# EAGLE design esp01-rs485 (EAGLE 7.2.0)
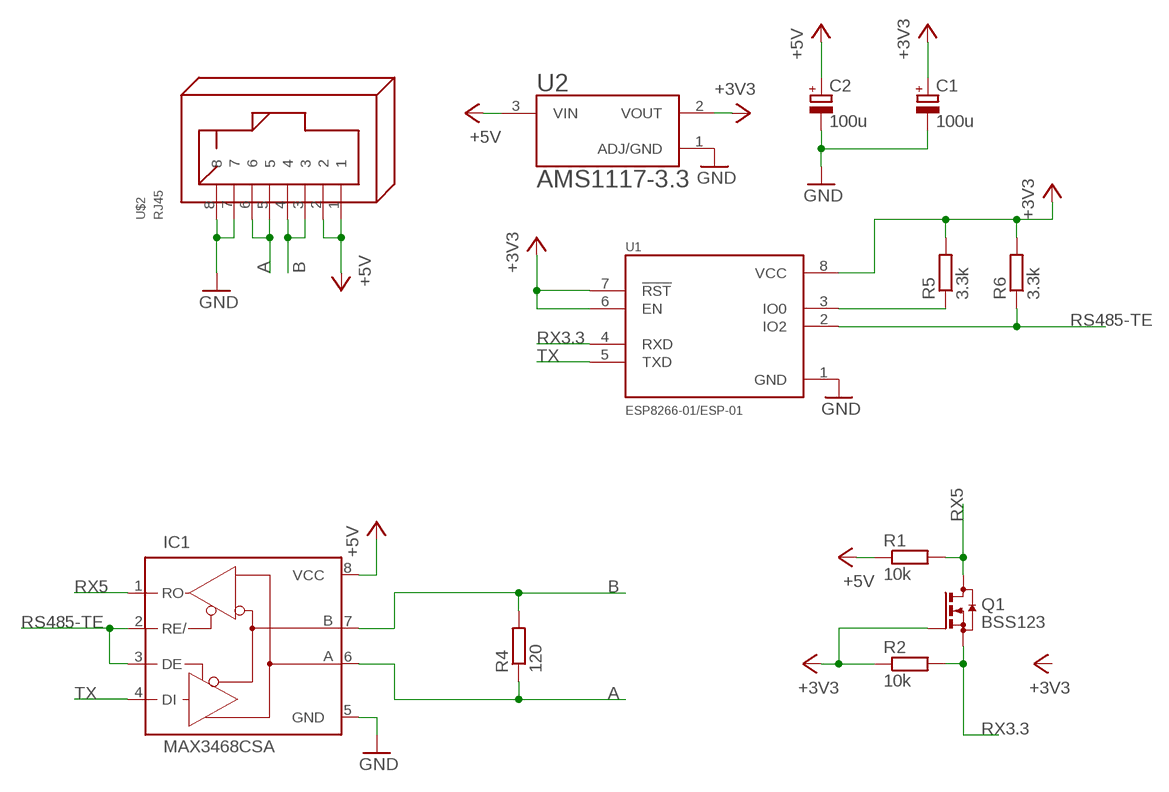
[diagram p0: schematic, sheet 1]

## Parts
C1  100u  CPOL-EUE2.5-6  [E2,5-6]
C2  100u  CPOL-EUE2.5-6  [E2,5-6]
IC1  MAX3468CSA  [SO08]
Q1  BSS123  [SOT23]
R1  10k  R-EU_M1206  [M1206]
R2  10k  R-EU_M1206  [M1206]
R4  120  R-EU_M1206  [M1206]
R5  3.3k  R-EU_M1206  [M1206]
R6  3.3k  R-EU_M1206  [M1206]
U1  ESP8266-01/ESP-01  [XCVR_ESP8266-01/ESP-01]
U2  AMS1117-3.3  [SOT229P700X180-4N]
U$2  RJ45  [RJ45]

## Nets
+3V3: C1.+ Q1.1(G) R2.1 R5.2 R6.2 U1.6(EN) U1.7(!RST) U1.8(VCC) U2.2(VOUT)
+5V: C2.+ IC1.8(VCC) R1.1 U2.3(VIN) U$2.1 U$2.2
A: IC1.6(A) R4.1 U$2.5 U$2.6
B: IC1.7(B) R4.2 U$2.3 U$2.4
GND: C1.- C2.- IC1.5(GND) U1.1(GND) U2.1(ADJ/GND) U$2.7 U$2.8
N$1: R5.1 U1.3(IO0)
RS485-TE: IC1.2(RE/) IC1.3(DE) R6.1 U1.2(IO2)
RX3.3: Q1.2(S) R2.2 U1.4(RXD)
RX5: IC1.1(RO) Q1.3(D) R1.2
TX: IC1.4(DI) U1.5(TXD)

## Library data of the parts
C1 C2 = rcl:CPOL-EU: POLARIZED CAPACITOR, European symbol
IC1 = maxim:MAX34*: +5V, Fail-Safe, 40Mbps, Profibus RS-485/RS-422 Transceivers Source: MAX3465-MAX3469.pdf; MPN: MAX3468CSA+; OC_FARNELL: unknown; OC_NEWARK: 76K6721
Q1 = transistor-small-signal:BSS123: N-CHANNEL MOS FET
R1 R2 R4-R6 = rcl:R-EU_: RESISTOR, European symbol
U1 = ESP8266-01_ESP-01:ESP8266-01/ESP-01: MakerFocus 4pcs ESP8266 ESP-01 Serial Wireless WiFi Transceiver Receiver Module 1MB SPI Flash DC3.0-3.6V Internet of Things WiFi Module Board Compatible with Ar duino Check prices <https://pricing.snapeda.com/parts/ESP8266-01/ESP-01/AI-Thinker/view-part?ref=eda>; AVAILABILITY: Not in stock; DESCRIPTION: MakerFocus 4pcs ESP8266 ESP-01 Serial Wireless WiFi Transceiver Receiver Module 1MB SPI Flash DC3.0-3.6V Internet of Things WiFi Module Board Compatible with Ar duino; MF: AI-Thinker; MP: ESP8266-01/ESP-01; PACKAGE: Non-Standard AI-Thinker; PRICE: None
U2 = AMS1117-3.3:AMS1117-3.3: Sot223/Pkg 1-Amp 3.3-Volt Low Drop Out Voltage Regulatator Check prices <https://pricing.snapeda.com/parts/AMS1117-3.3/Advanced%20Monolithic%20Systems/view-part?ref=eda>; AVAILABILITY: In Stock; DESCRIPTION: LDO Voltage Regulators 800MA LDO LINEAR REG; MF: Advanced Monolithic Systems; MP: AMS1117-3.3; PACKAGE: SOT-223 Seeed Technology; PRICE: None
U$2 = con-rj:RJ45: RJ45 RJ45 jacks side mounted http://www.tycoelectronics.com

## Board
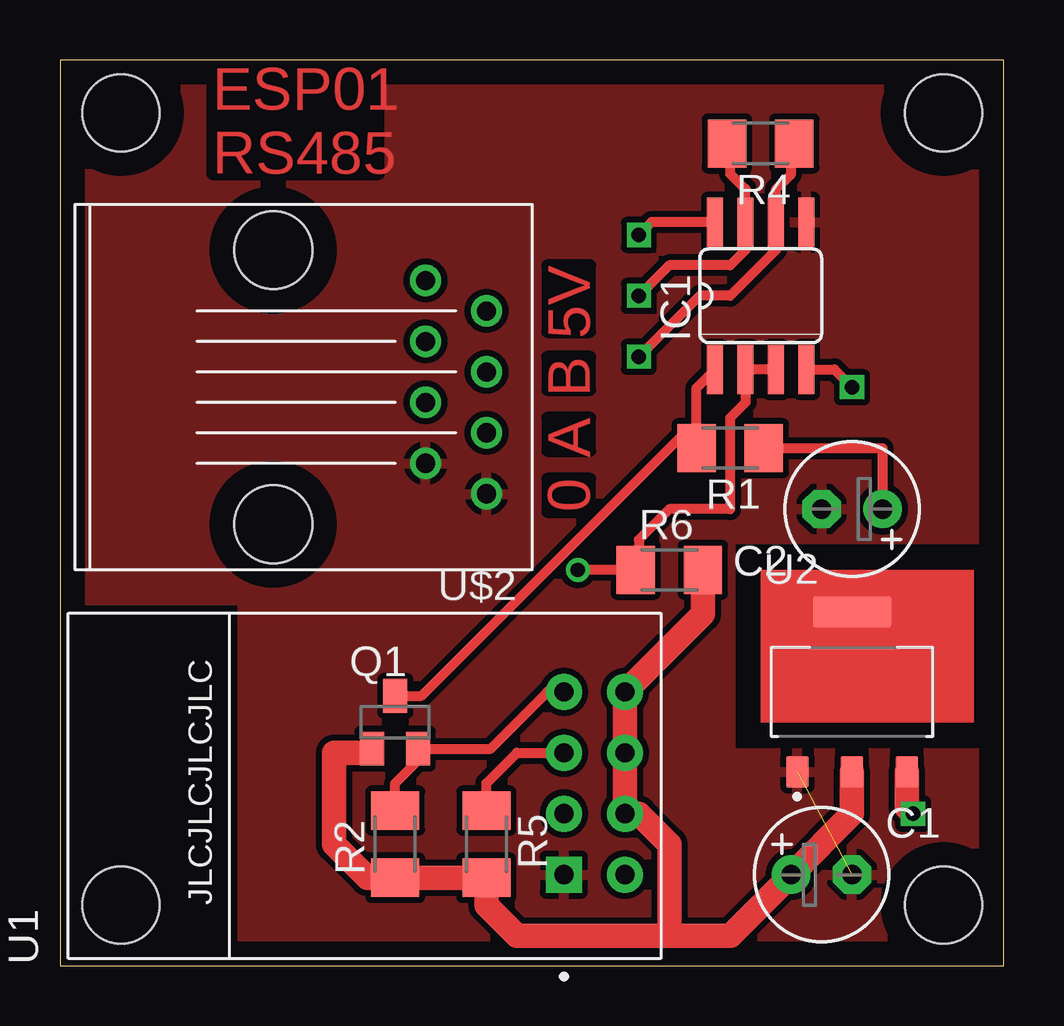
[diagram p1: board, top side]
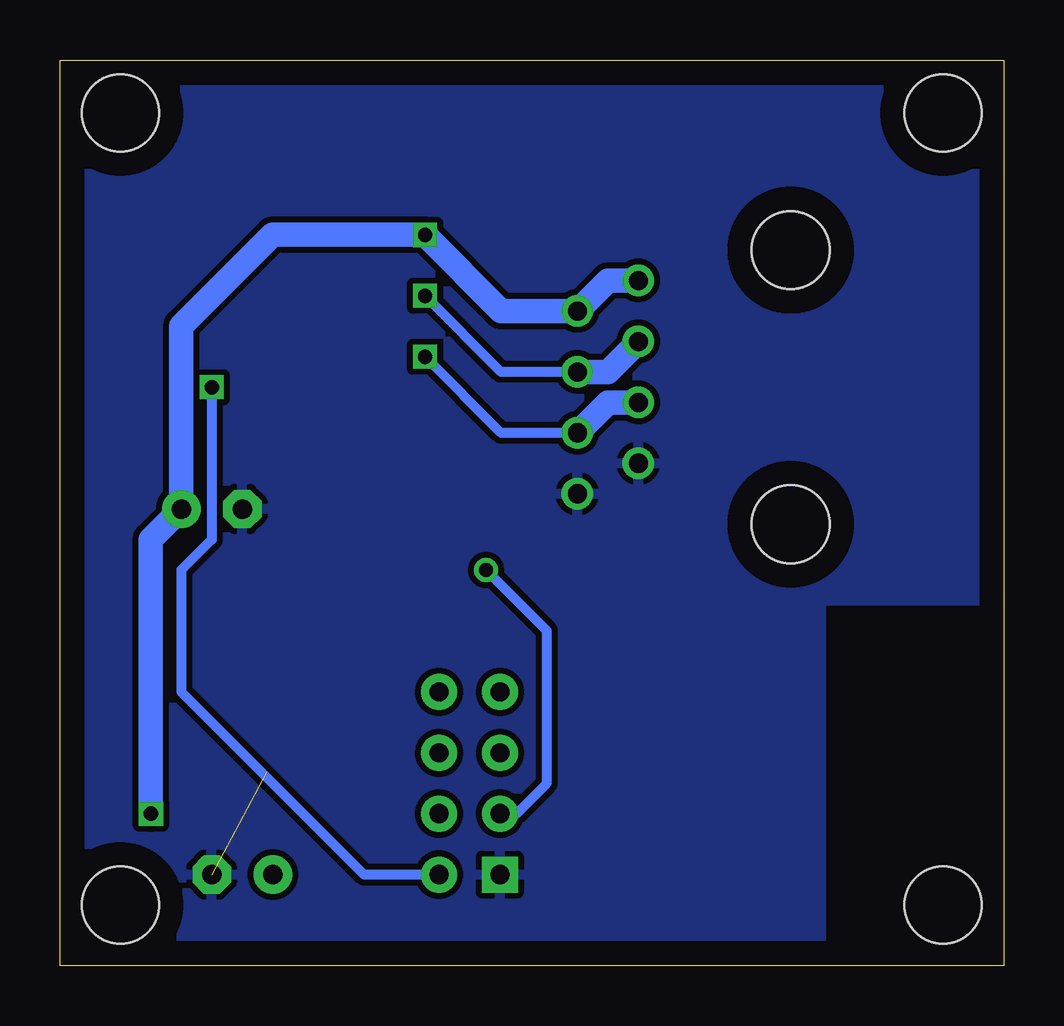
[diagram p2: board, bottom side, seen from below]

Size 39.35 x 37.77 mm. Coordinates in mm from the lower left corner, seen from the top.
Outline: 0,0 39.35,0 39.35,37.77 0,37.77 0,0
Copper layers (1*16): Top 0.035mm / dielectric 1.5mm / Bottom 0.035mm
Design rules "default *": minimum track width 10mil, minimum drill 24mil, track to track 10mil, track to pad 10mil, pad to pad 10mil, via to via 10mil, smd to smd 8mil, copper to edge 40mil, drill to drill 8mil, minimum pad ring 10mil, minimum via ring 8mil, stop-mask expansion 4mil, vias tented up to drill 0mil, thermal gap 10mil
Holes 3.2 mm at 2.54,35.56 2.54,2.54 36.83,2.54 36.83,35.56

### Footprints (pad centres in the part's own frame; a part is rotated, then mirrored left to right if it is on the bottom)
E2,5-6 = drill 0.813 pad 1.6: + -1.27,0 | drill 0.813 pad 1.6 octagon: - 1.27,0
SO08 = smd 0.66 x 2.032: 1 -1.905,-3.073; 2 -0.635,-3.073; 3 0.635,-3.073; 4 1.905,-3.073; 5 1.905,3.073; 6 0.635,3.073; 7 -0.635,3.073; 8 -1.905,3.073
SOT23 = smd 1 x 1.4: 1 -0.95,-1.1; 2 0.95,-1.1; 3 0,1.1
M1206 = smd 1.6 x 2: 1 -1.4,0; 2 1.4,0
XCVR_ESP8266-01/ESP-01 = drill 0.8 pad 1.5 square: 1 -3.81,-8.31 | drill 0.8 pad 1.5: 2 -1.27,-8.31; 3 1.27,-8.31; 4 3.81,-8.31; 5 -3.81,-10.85; 6 -1.27,-10.85; 7 1.27,-10.85; 8 3.81,-10.85
SOT229P700X180-4N = smd 0.93 x 1.31: 1 -2.29,-3.345; 2 0,-3.345; 3 2.29,-3.345 | smd 3.24 x 1.31: 4 0,3.345
RJ45 = drill 0.8: 1 -6.35,-4.445; 2 -8.89,-3.175; 3 -6.35,-1.905; 4 -8.89,-0.635; 5 -6.35,0.635; 6 -8.89,1.905; 7 -6.35,3.175; 8 -8.89,4.445 | hole 3.25: 0,-5.715; 0,5.715

### Placement (x,y rotation side)
C1  31.75,3.81 0 top
C2  33.02,19.05 180 top
IC1  29.21,27.94 0 top
Q1  13.97,10.16 0 top
R1  27.94,21.59 180 top
R2  13.97,5.08 90 top
R4  29.21,34.29 180 top
R5  17.78,5.08 270 top
R6  25.4,16.51 0 top
U1  12.7,7.62 90 top
U2  33.02,11.43 0 top
U$2  8.89,24.13 180 top

### Tracks (layer width: path | path; a pad name or v marks a point on that pad's centre or on a via)
+3V3
  Top 1.016: U2.2 33.02,6.35 C1.+ 27.94,1.27 25.4,1.27 | 25.4,1.27 19.05,1.27 17.78,2.54 R5.2 R2.1 12.83,3.68 11.43,5.08 11.43,8.89 12.85,8.89 Q1.1 | 25.4,1.27 25.4,5.08 24.13,6.35 U1.6 U1.7 U1.8 26.8,14.68 R6.2
+5V  (via drill 0.6)
  Top 0.406: R1.1 34.29,21.59 C2.+ | IC1.8 24.66,31.01 v24.13,30.48
  Top 1.016: U2.3 35.31,6.6 v35.56,6.35
  Bottom 1.016: U$2.1 16.51,28.57 U$2.2 20.95,27.3 v24.13,30.48 30.48,30.48 34.29,26.67 C2.+ 35.56,17.78 v35.56,6.35
A  (via drill 0.6)
  Top 0.406: 30.48,34.16 30.48,33.02 29.84,32.38 IC1.6 29.84,29.84 27.94,27.94 26.67,27.94 v24.13,25.4
  Top 1.016: 30.48,34.16 R4.1
  Bottom 0.406: U$2.6 20.95,22.23 v24.13,25.4
  Bottom 1.016: U$2.5 16.51,23.5 U$2.6
B  (via drill 0.6)
  Top 0.406: 27.94,34.16 27.94,33.02 28.57,32.38 IC1.7 28.57,29.84 27.94,29.21 25.4,29.21 v24.13,27.94
  Top 1.016: 27.94,34.16 R4.2
  Bottom 0.406: U$2.4 20.95,24.77 v24.13,27.94
  Bottom 1.016: U$2.4 16.51,24.77 U$2.3
GND  (1 unrouted)
  pour Bottom: 0,38.1 39.37,38.1 39.37,0 7.62,0 7.62,15.24 0,15.24
  pour Top: 0,38.1 39.37,38.1 39.37,17.78 27.94,17.78 27.94,8.89 39.37,8.89 39.37,0 7.62,0 7.62,15.24 0,15.24
N$1
  Top 0.406: R5.1 17.78,7.62 19.05,8.89 U1.3
RS485-TE  (via drill 0.6)
  Top 0.406: v21.59,16.51 R6.1 24.13,16.64 24.13,17.78 25.4,19.05 27.94,19.05 27.94,22.86 28.57,23.5 IC1.2 IC1.3
  Bottom 0.406: U1.2 20.32,6.35 19.05,7.62 19.05,13.97 v21.59,16.51
RX3.3
  Top 0.406: R2.2 13.97,7.62 15.24,8.89 15.09,8.89 Q1.2 17.95,9.06 20.32,11.43 U1.4
RX5
  Top 0.406: Q1.3 15.07,11.26 26.04,22.23 26.54,21.72 R1.2 26.54,24.1 IC1.1
TX  (via drill 0.6)
  Top 0.406: IC1.4 32.28,24.87 v33.02,24.13
  Bottom 0.406: U1.5 26.67,3.81 34.29,11.43 34.29,16.51 33.02,17.78 v33.02,24.13
(copper drawn outside any net)
  shapes: Top area x1

### Text on the board
Top: ESP01 / RS485 | 5V | B | A | 0
tPlace: JLCJLCJLCJLC